# EAGLE schematic octanis_eps_revised (EAGLE 7.1.0)
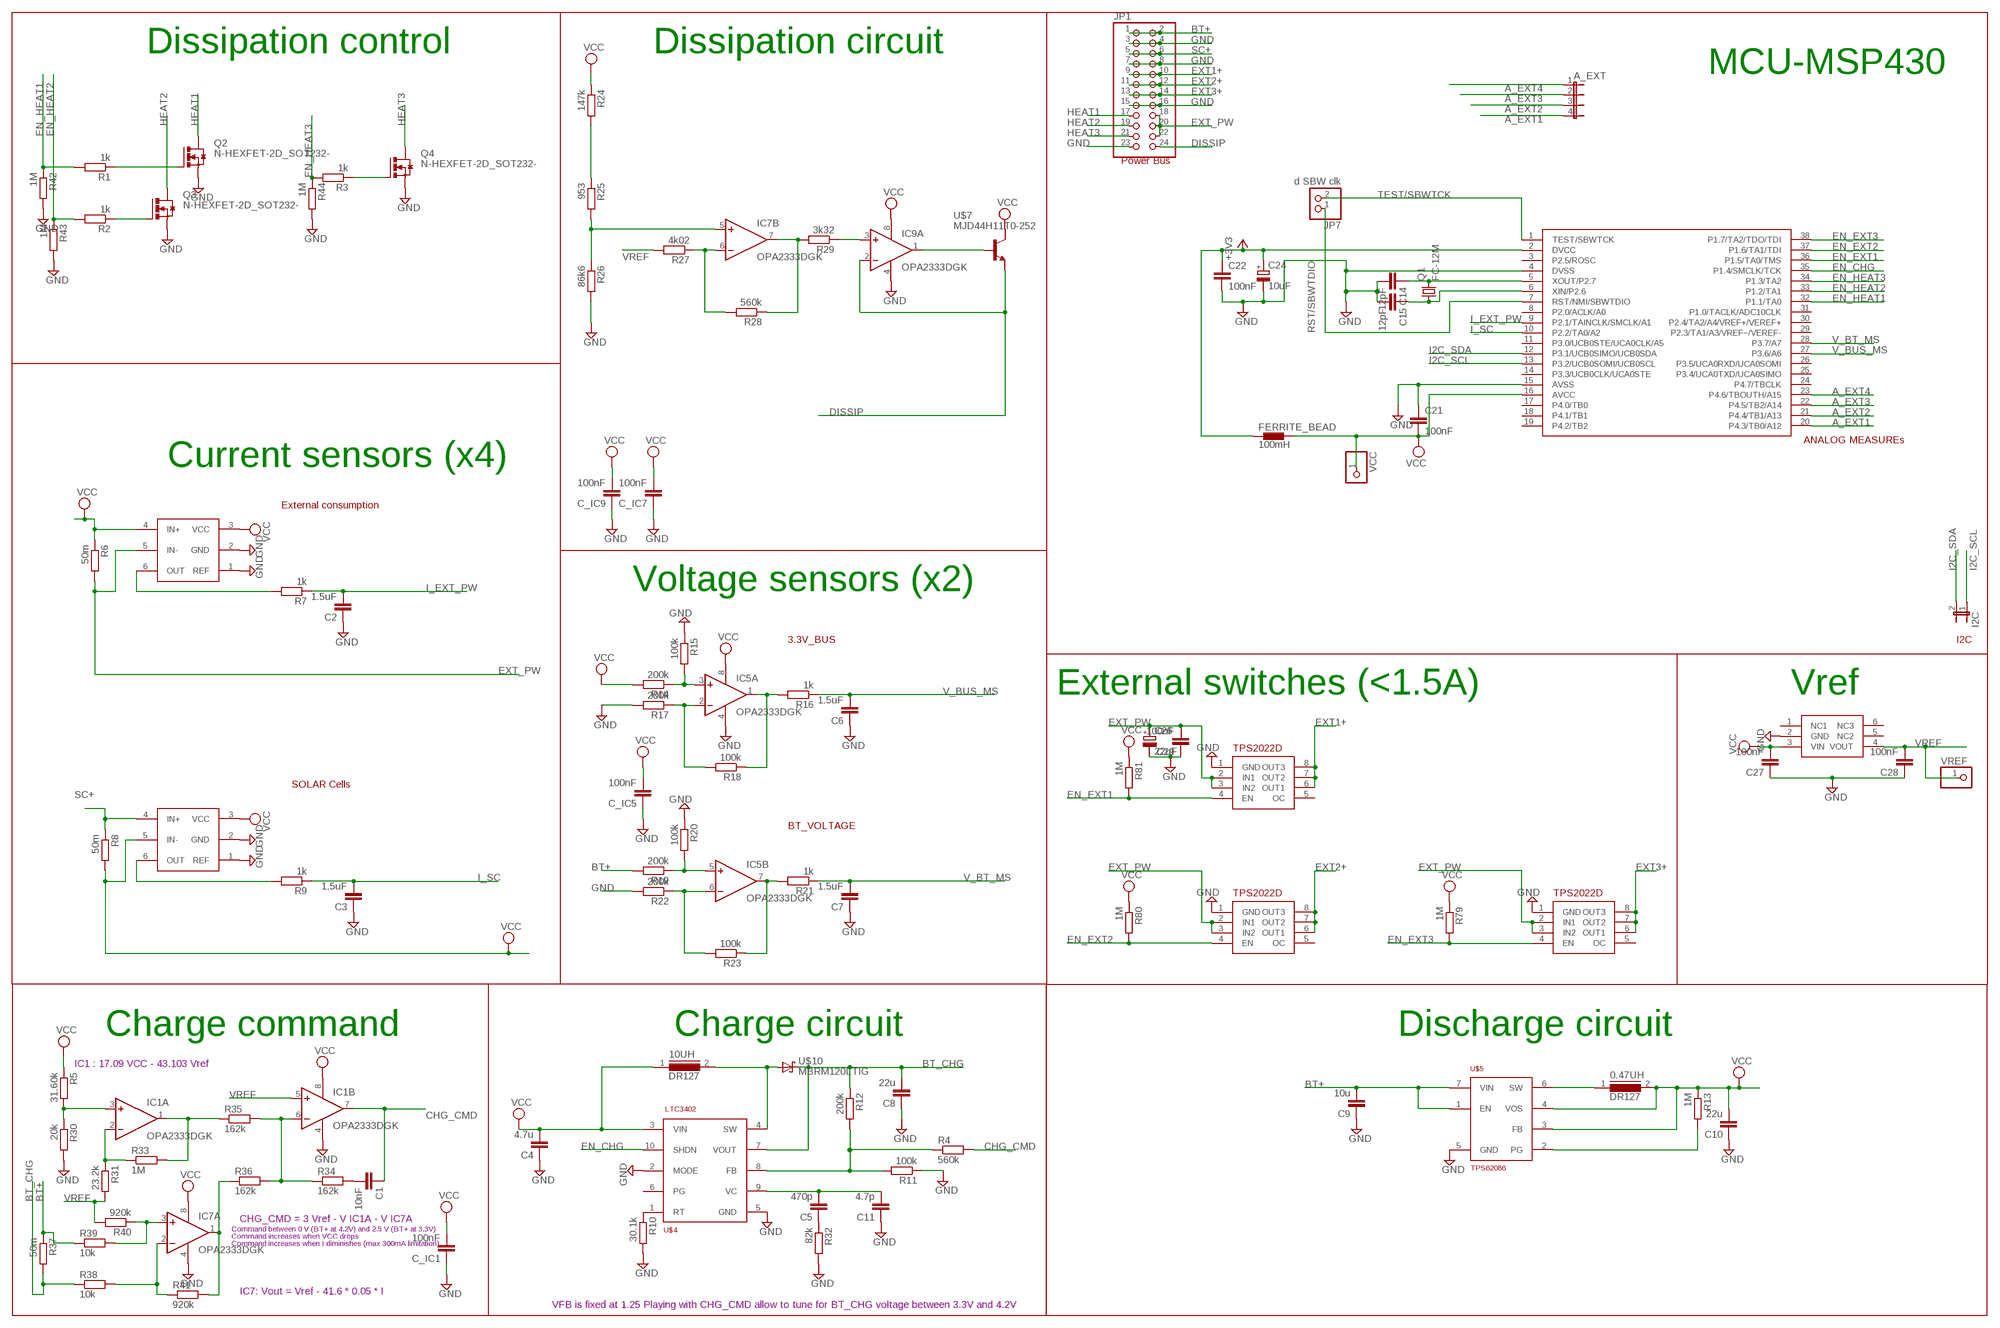
[diagram p0: schematic, sheet 1]

## Parts
0.47UH  DR127  [DR127]
10UH  DR127  [DR127]
A_EXT  JP4E  [JP4]
C1  10nF  C-EUC0603  [C0603]
C2  1.5uF  C-EUC0603  [C0603]
C3  1.5uF  C-EUC0603  [C0603]
C4  4.7u  C-EUC1206  [C1206]
C5  470p  C-EUC0603  [C0603]
C6  1.5uF  C-EUC0603  [C0603]
C7  1.5uF  C-EUC0603  [C0603]
C8  22u  C-EUC0603  [C0603]
C9  10u  C-EUC1206  [C1206]
C10  22u  C-EUC1206  [C1206]
C11  4.7p  C-EUC0603  [C0603]
C14  12pF  C-EUC0603  [C0603]
C15  12pF  C-EUC0603  [C0603]
C21  100nF  C-EUC0603  [C0603]
C22  100nF  C-EUC0603  [C0603]
C24  10uF  CPOL-EUA/3216-18R  [A/3216-18R]
C26  22uF  CPOL-EUA/3216-18R  [A/3216-18R]
C27  100nF  C-EUC0603  [C0603]
C28  100nF  C-EUC0603  [C0603]
C29  100nF  C-EUC0603  [C0603]
C_IC1  100nF  C-EUC0603  [C0603]
C_IC5  100nF  C-EUC0603  [C0603]
C_IC7  100nF  C-EUC0603  [C0603]
C_IC9  100nF  C-EUC0603  [C0603]
FERRITE_BEAD  100mH  BLM15HD601SN1  [0402]
I2C  JP1E  [JP1]
IC1  OPA2333DGK  [MSOP08]
IC5  OPA2333DGK  [MSOP08]
IC7  OPA2333DGK  [MSOP08]
IC9  OPA2333DGK  [MSOP08]
JP1  PINHD-2X12  [2X12]
JP7  d SBW clk  PINHD-1X2  [1X02]
Q1  FC-12M  [FC-12M]
Q2  N-HEXFET-2D_SOT232-  [SOT223]
Q3  N-HEXFET-2D_SOT232-  [SOT223]
Q4  N-HEXFET-2D_SOT232-  [SOT223]
R1  1k  R-EU_R0603  [R0603]
R2  1k  R-EU_R0603  [R0603]
R3  1k  R-EU_R0603  [R0603]
R4  560k  R-EU_R0603  [R0603]
R5  31.60k  R-EU_R0603  [R0603]
R6  50m  R-EU_R1206  [R1206]
R7  1k  R-EU_R0603  [R0603]
R8  50m  R-EU_R1206  [R1206]
R9  1k  R-EU_R0603  [R0603]
R10  30.1k  R-EU_R0603  [R0603]
R11  100k  R-EU_R0603  [R0603]
R12  200k  R-EU_R0603  [R0603]
R13  1M  R-EU_R0603  [R0603]
R14  200k  R-EU_R0603  [R0603]
R15  100k  R-EU_R0603  [R0603]
R16  1k  R-EU_R0603  [R0603]
R17  200k  R-EU_R0603  [R0603]
R18  100k  R-EU_R0603  [R0603]
R19  200k  R-EU_R0603  [R0603]
R20  100k  R-EU_R0603  [R0603]
R21  1k  R-EU_R0603  [R0603]
R22  200k  R-EU_R0603  [R0603]
R23  100k  R-EU_R0603  [R0603]
R24  147k  R-EU_R0603  [R0603]
R25  953  R-EU_R0603  [R0603]
R26  86k6  R-EU_R0603  [R0603]
R27  4k02  R-EU_R0603  [R0603]
R28  560k  R-EU_R0603  [R0603]
R29  3k32  R-EU_R0603  [R0603]
R30  20k  R-EU_R0603  [R0603]
R31  23.2k  R-EU_R0603  [R0603]
R32  82k  R-EU_R0603  [R0603]
R33  1M  R-EU_R0603  [R0603]
R34  162k  R-EU_R0603  [R0603]
R35  162k  R-EU_R0603  [R0603]
R36  162k  R-EU_R0603  [R0603]
R37  50m  R-EU_R1206  [R1206]
R38  10k  R-EU_R0603  [R0603]
R39  10k  R-EU_R0603  [R0603]
R40  920k  R-EU_R0603  [R0603]
R41  920k  R-EU_R0603  [R0603]
R42  1M  R-EU_R0603  [R0603]
R43  1M  R-EU_R0603  [R0603]
R44  1M  R-EU_R0603  [R0603]
R79  1M  R-EU_R0603  [R0603]
R80  1M  R-EU_R0603  [R0603]
R81  1M  R-EU_R0603  [R0603]
U$2  INA213  [SC70-6]
U$3  INA213  [SC70-6]
U$4  LTC3402  [MSOP10]
U$5  TPS62086  [QFN-7]
U$6  MSP430G2544  [TSSOP38]
U$7  MJD44H11T0-252  [TO252]
U$10  MBRM120LTIG  [DO216AA]
U$16  TPS2022D  [SO8]
U$17  TPS2022D  [SO8]
U$18  TPS2022D  [SO8]
U$19  ADR127B  [TSOT23-6]
VCC  PINHD-1X1  [1X01]
VREF  PINHD-1X1  [1X01]

## Nets
+3V3: C22.1 C24.+ FERRITE_BEAD.1 U$6.2(DVCC)
A_EXT1: A_EXT.4 U$6.20(P4.3/TB0/A12)
A_EXT2: A_EXT.3 U$6.21(P4.4/TB1/A13)
A_EXT3: A_EXT.2 U$6.22(P4.5/TB2/A14)
A_EXT4: A_EXT.1 U$6.23(P4.6/TBOUTH/A15)
BT+: C9.2 JP1.1 JP1.2 R19.2 R37.1 R39.1 U$5.1(EN) U$5.7(VIN)
BT_CHG: C8.2 R12.1 R37.2 R38.1 U$4.7(VOUT) U$10.C(K)
CHG_CMD: C1.1 IC1.7(B:OUT) R4.2
DISSIP: IC9.2(A:-IN) JP1.24 U$7.3(E)
EN_CHG: U$4.10(SHDN) U$6.35(P1.4/SMCLK/TCK)
EN_EXT1: R81.2 U$6.36(P1.5/TA0/TMS) U$16.4(EN)
EN_EXT2: R80.2 U$6.37(P1.6/TA1/TDI) U$17.4(EN)
EN_EXT3: R79.2 U$6.38(P1.7/TA2/TDO/TDI) U$18.4(EN)
EN_HEAT1: R1.2 R42.1 U$6.32(P1.1/TA0)
EN_HEAT2: R2.2 R43.1 U$6.33(P1.2/TA1)
EN_HEAT3: R3.2 R44.1 U$6.34(P1.3/TA2)
EXT1+: JP1.9 JP1.10 U$16.6(OUT1) U$16.7(OUT2) U$16.8(OUT3)
EXT2+: JP1.11 JP1.12 U$17.6(OUT1) U$17.7(OUT2) U$17.8(OUT3)
EXT3+: JP1.13 JP1.14 U$18.6(OUT1) U$18.7(OUT2) U$18.8(OUT3)
EXT_PW: C26.+ C29.2 JP1.18 JP1.20 JP1.22 R6.2 U$2.5(IN-) U$16.2(IN1) U$16.3(IN2) U$17.2(IN1) U$17.3(IN2) U$18.2(IN1) U$18.3(IN2)
GND: C2.1 C3.1 C4.1 C6.1 C7.1 C8.1 C9.1 C10.1 C11.1 C14.2 C15.2 C21.1 C22.2 C24.- C26.- C27.1 C28.1 C29.1 C_IC1.1 C_IC5.1 C_IC7.1 C_IC9.1 IC1.4(P:V-) IC5.4(P:V-) IC7.4(P:V-) IC9.4(P:V-) JP1.3 JP1.4 JP1.7 JP1.8 JP1.15 JP1.16 JP1.23 Q2.3(S) Q3.3(S) Q4.3(S) R10.2 R11.1 R15.1 R17.2 R20.1 R22.2 R26.2 R30.2 R32.2 R42.2 R43.2 R44.2 U$2.1(REF) U$2.2(GND) U$3.1(REF) U$3.2(GND) U$4.2(MODE) U$4.5(GND) U$5.5(GND) U$6.4(DVSS) U$6.15(AVSS) U$16.1(GND) U$17.1(GND) U$18.1(GND) U$19.2(GND)
HEAT1: JP1.17 Q2.2(D) Q2.4(D)
HEAT2: JP1.19 Q3.2(D) Q3.4(D)
HEAT3: JP1.21 Q4.2(D) Q4.4(D)
I2C_SCL: I2C.1 U$6.13(P3.2/UCB0SOMI/UCB0SCL)
I2C_SDA: I2C.2 U$6.12(P3.1/UCB0SIMO/UCB0SDA)
I_EXT_PW: C2.2 R7.1 U$6.9(P2.1/TAINCLK/SMCLK/A1)
I_SC: C3.2 R9.1 U$6.10(P2.2/TA0/A2)
N$1: R7.2 U$2.6(OUT)
N$2: R9.2 U$3.6(OUT)
N$3: R10.1 U$4.1(RT)
N$4: C5.1 R32.1
N$5: IC7.1(A:OUT) R36.1 R41.2
N$6: IC1.3(A:+IN) R5.2 R30.1
N$7: IC1.2(A:-IN) R31.1 R33.1
N$8: C5.2 C11.2 U$4.9(VC)
N$9: IC1.1(A:OUT) R33.2 R35.1
N$10: IC5.7(B:OUT) R21.2 R23.1
N$11: IC1.6(B:-IN) R34.1 R35.2 R36.2
N$12: IC5.1(A:OUT) R16.2 R18.1
N$13: IC5.2(A:-IN) R17.1 R18.2
N$14: IC5.3(A:+IN) R14.1 R15.2
N$15: IC5.6(B:-IN) R22.1 R23.2
N$16: IC5.5(B:+IN) R19.1 R20.2
N$17: IC7.2(A:-IN) R38.2 R41.1
N$18: R24.2 R25.1
N$19: IC7.5(B:+IN) R25.2 R26.1
N$20: IC7.6(B:-IN) R27.1 R28.2
N$21: IC7.7(B:OUT) R28.1 R29.2
N$22: IC9.3(A:+IN) R29.1
N$23: R4.1 R11.2 R12.2 U$4.8(FB)
N$24: 10UH.2 U$4.4(SW) U$10.A
N$25: R13.2 U$5.2(PG)
N$26: 0.47UH.1 U$5.6(SW)
N$27: C1.2 R34.2
N$28: IC7.3(A:+IN) R39.2 R40.1
N$29: Q2.1(G) R1.1
N$31: Q3.1(G) R2.1
N$37: Q4.1(G) R3.1
N$45: IC9.1(A:OUT) U$7.1(B)
N$48: C14.1 Q1.2 U$6.5(XOUT/P2.7)
N$50: C15.1 Q1.1 U$6.6(XIN/P2.6)
RST/SBWTDIO: JP7.1 U$6.7(RST/NMI/SBWTDIO)
SC+: JP1.5 JP1.6 R8.1 U$3.4(IN+)
TEST/SBWTCK: JP7.2 U$6.1(TEST/SBWTCK)
V_BT_MS: C7.2 R21.1 U$6.28(P3.7/A7)
V_BUS_MS: C6.2 R16.1 U$6.27(P3.6/A6)
VCC: 0.47UH.2 10UH.1 C4.2 C10.2 C21.2 C27.2 C_IC1.2 C_IC5.2 C_IC7.2 C_IC9.2 FERRITE_BEAD.2 IC1.8(P:V+) IC5.8(P:V+) IC7.8(P:V+) IC9.8(P:V+) R5.1 R6.1 R8.2 R13.1 R14.2 R24.1 R79.1 R80.1 R81.1 U$2.3(VCC) U$2.4(IN+) U$3.3(VCC) U$3.5(IN-) U$4.3(VIN) U$5.3(FB) U$5.4(VOS) U$6.16(AVCC) U$7.2(C) U$19.3(VIN) VCC.1
VREF: C28.2 IC1.5(B:+IN) R27.2 R31.2 R40.2 U$19.4(VOUT) VREF.1
Unconnected: IC9.5(B:+IN) IC9.6(B:-IN) IC9.7(B:OUT) U$4.6(PG) U$6.3(P2.5/ROSC) U$6.8(P2.0/ACLK/A0) U$6.11(P3.0/UCB0STE/UCA0CLK/A5) U$6.14(P3.3/UCB0CLK/UCA0STE) U$6.17(P4.0/TB0) U$6.18(P4.1/TB1) U$6.19(P4.2/TB2) U$6.24(P4.7/TBCLK) U$6.25(P3.4/UCA0TXD/UCA0SIMO) U$6.26(P3.5/UCA0RXD/UCA0SOMI) U$6.29(P2.3/TA1/A3/VREF−/VEREF-) U$6.30(P2.4/TA2/A4/VREF+/VEREF+) U$6.31(P1.0/TACLK/ADC10CLK) U$16.5(OC) U$17.5(OC) U$18.5(OC) U$19.1(NC1) U$19.5(NC2) U$19.6(NC3)

## Notes on the sheet
- Dissipation control | Dissipation circuit
- MCU-MSP430
- Power Bus
- ANALOG MEASUREs
- Current sensors (x4)
- External consumption
- Voltage sensors (x2)
- 3.3V_BUS | I2C
- External switches (<1.5A) | Vref
- SOLAR Cells
- BT_VOLTAGE
- Charge command | Charge circuit | Discharge circuit
- IC1 : 17.09 VCC - 43.103 Vref
- CHG_CMD = 3 Vref - V IC1A - V IC7A
- Command between 0 V (BT+ at 4.2V) and 2.5 V (BT+ at 3.3V)
- Command increases when VCC drops
- Command increases when I diminishes (max 300mA limitation)
- IC7: Vout = Vref - 41.6 * 0.05 * I
- VFB is fixed at 1.25 Playing with CHG_CMD allow to tune for BT_CHG voltage between 3.3V and 4.2V

## Library data of the parts
0.47UH 10UH = inductors:DR127: High Power Density, High Efficiency, Shielded Inductors Source: coiltronics_dr_series.pdf
A_EXT = jumper:JP4E: JUMPER
C1-C11 C14 C15 C21 C22 C27-C29 C_IC1 C_IC5 C_IC7 C_IC9 = rcl:C-EU: CAPACITOR, European symbol
C24 C26 = rcl:CPOL-EU: POLARIZED CAPACITOR, European symbol
FERRITE_BEAD = inductors:BLM15H: EMIFIL (R) Chip Ferrite Bead for GHz Noise Source: http://www.murata.com/ Ferrite Bead BLM15H.pdf
I2C = jumper:JP1E: JUMPER
IC1 IC5 IC7 IC9 = linear:OPA2333: DUAL 1.8V, microPOWER CMOS OPERATIONAL AMPLIFIERS Zerø-Drift Series Source: Texas Instruments (Burr-Brown) .. U11 opa333 Operational Amp.pdf
JP1 = pinhead:PINHD-2X12: PIN HEADER
JP7 = pinhead:PINHD-1X2: PIN HEADER
Q1 = crystal:FC-12M: kHz RANGE CRYSTAL UNIT LOW PROFILE SMD Source: Epson Toyocom FC-12M.pdf
Q2-Q4 = transistor-power:N-HEXFET-2D_?-*: HEXFET® Power MOSFET 2 Drain connects http://www.irf.com/product-info/datasheets/data/irll014n.pdf
R1-R44 R79-R81 = rcl:R-EU_: RESISTOR, European symbol
U$2 U$3 = Octanis1_EPS:INA213: Voltage Output, High or Low Side Measurement, Bi-Directional Zer ø -Drift Series Current-Shunt Monitor
U$4 = Octanis1_EPS:LTC3402: 1 LTC3402 3402fb 2A, 3MHz Micropower Synchronous Boost Converter
U$5 = Octanis1_EPS:TPS62086: 3-A Step-Down Converter with Hiccup Short Circuit Protection in 2x2 QFN Package Fixed 3.3V operation
U$6 = Octanis1_EPS:MSP430G2544: MSP430G2x44 Mixed-Signal Microcontrollers
U$7 = Octanis1_EPS:MJD44H11: MJD44H11, MJD45H11 Complementary power transistors
U$10 = Octanis1_EPS:MBRM120LTIG
U$16-U$18 = Octanis1_EPS:TPS2022D: TEXAS INSTRUMENTS - TPS2022D - IC, 1.5A PWR DIST SWITCH 8SOIC
U$19 = Octanis1_EPS:ADR127B: ANALOG DEVICES - ADR127BUJZ-REEL7 - VOLTAGE REFERENCE, SERIES, 3.3V, TSOT-6
VCC VREF = pinhead:PINHD-1X1: PIN HEADER

## Net classes
0 default: clearance 0.205 mm